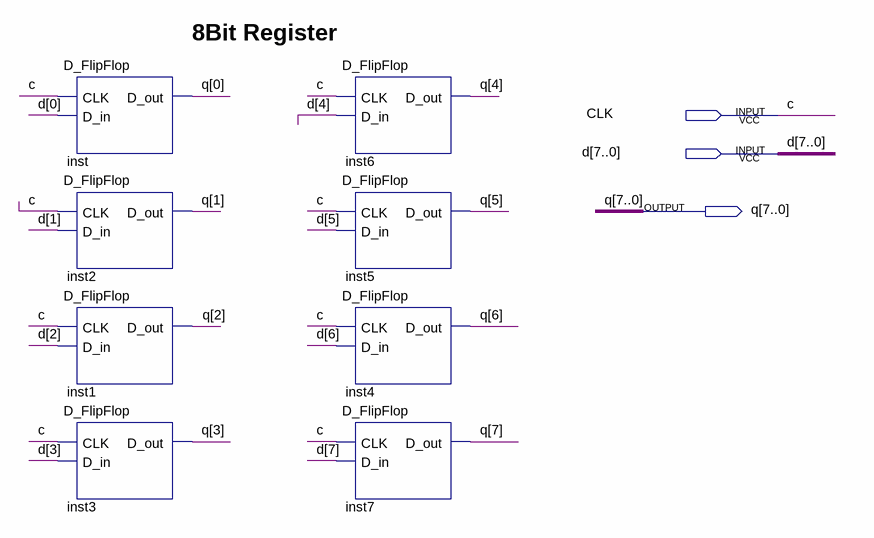
[diagram p0: schematic sheet]
// Quartus schematic Registereightbit.bdf as structural Verilog: 8 symbols, 3 pins
module Registereightbit (
  input  CLK,
  input  [7:0] d,
  output [7:0] q
);

  D_FlipFlop inst (.CLK(CLK), .D_in(d[0]), .D_out(q[0]));
  D_FlipFlop inst2 (.CLK(CLK), .D_in(d[1]), .D_out(q[1]));
  D_FlipFlop inst1 (.CLK(CLK), .D_in(d[2]), .D_out(q[2]));
  D_FlipFlop inst3 (.CLK(CLK), .D_in(d[3]), .D_out(q[3]));
  D_FlipFlop inst6 (.CLK(CLK), .D_in(d[4]), .D_out(q[4]));
  D_FlipFlop inst5 (.CLK(CLK), .D_in(d[5]), .D_out(q[5]));
  D_FlipFlop inst4 (.CLK(CLK), .D_in(d[6]), .D_out(q[6]));
  D_FlipFlop inst7 (.CLK(CLK), .D_in(d[7]), .D_out(q[7]));

  // Other names for the same wires on the sheet: c = CLK

  // Notes on the sheet:
  //   8Bit Register
endmodule
